# Altium schematic sheet MCU_POWER.SchDoc: STM32 microcontroller Power
size 420 x 297 mm; CompanyName: STMicroelectronics; Organization: Microcontrollers Division; DocumentNumber: 15; SheetNumber: 16; SheetTotal: 17
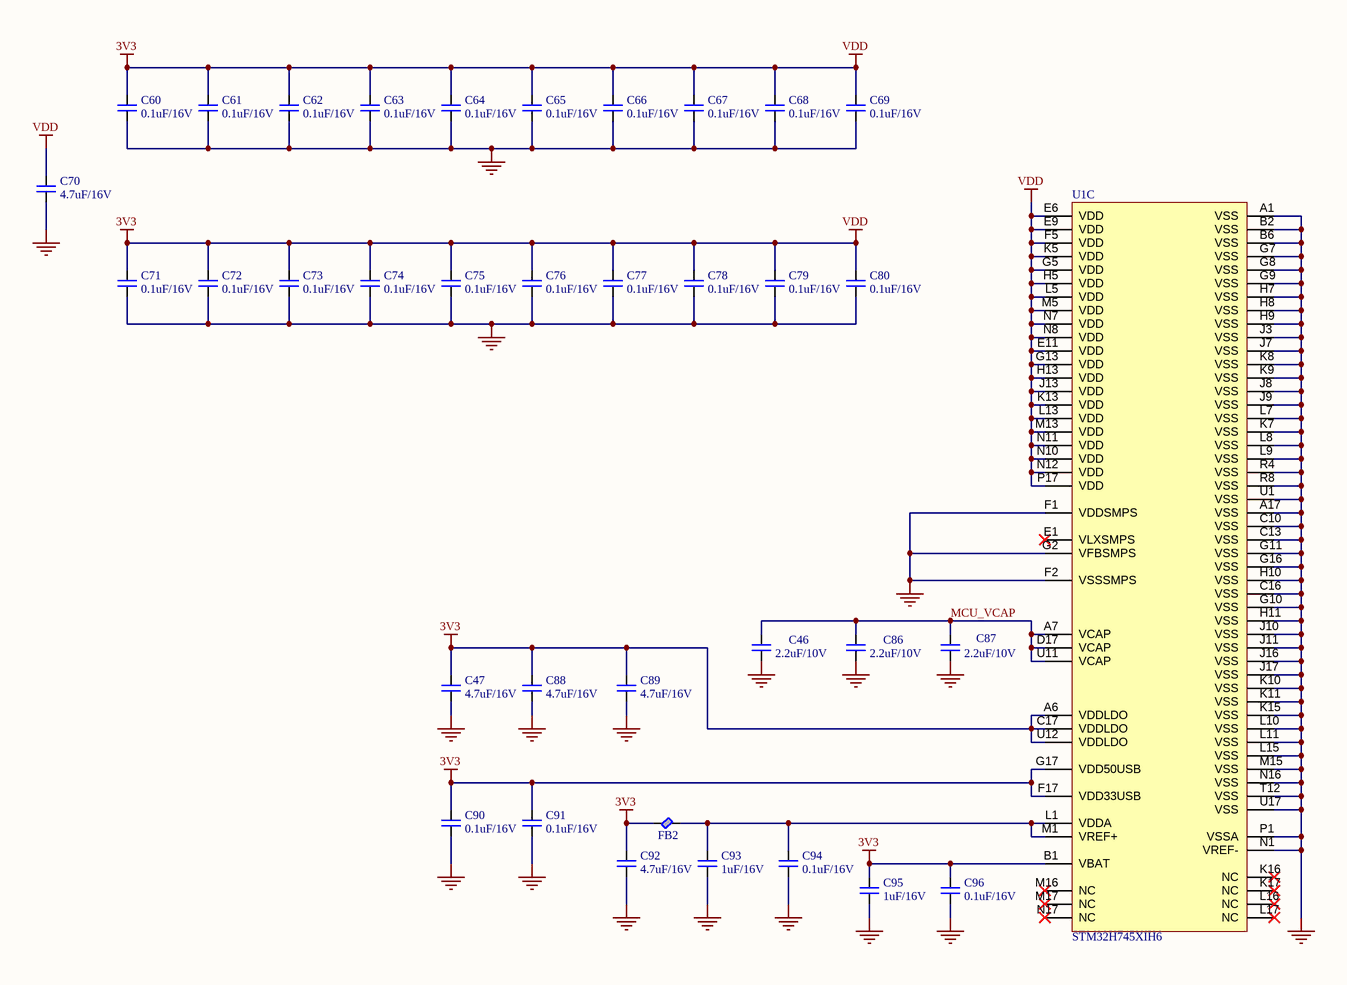
[diagram p0: MCU_POWER.SchDoc]

## Parts
C46  2.2uF/10V  [CAP_C_1608X80]
C47  4.7uF/16V  [CAP_C_1608X80]
C60  0.1uF/16V  [CAP_C_1608X80]
C61  0.1uF/16V  [CAP_C_1608X80]
C62  0.1uF/16V  [CAP_C_1608X80]
C63  0.1uF/16V  [CAP_C_1608X80]
C64  0.1uF/16V  [CAP_C_1608X80]
C65  0.1uF/16V  [CAP_C_1608X80]
C66  0.1uF/16V  [CAP_C_1608X80]
C67  0.1uF/16V  [CAP_C_1608X80]
C68  0.1uF/16V  [CAP_C_1608X80]
C69  0.1uF/16V  [CAP_C_1608X80]
C70  4.7uF/16V  [CAP_C_1608X80]
C71  0.1uF/16V  [CAP_C_1608X80]
C72  0.1uF/16V  [CAP_C_1608X80]
C73  0.1uF/16V  [CAP_C_1608X80]
C74  0.1uF/16V  [CAP_C_1608X80]
C75  0.1uF/16V  [CAP_C_1608X80]
C76  0.1uF/16V  [CAP_C_1608X80]
C77  0.1uF/16V  [CAP_C_1608X80]
C78  0.1uF/16V  [CAP_C_1608X80]
C79  0.1uF/16V  [CAP_C_1608X80]
C80  0.1uF/16V  [CAP_C_1608X80]
C86  2.2uF/10V  [CAP_C_1608X80]
C87  2.2uF/10V  [CAP_C_1608X80]
C88  4.7uF/16V  [CAP_C_1608X80]
C89  4.7uF/16V  [CAP_C_1608X80]
C90  0.1uF/16V  [CAP_C_1608X80]
C91  0.1uF/16V  [CAP_C_1608X80]
C92  4.7uF/16V  [CAP_C_1608X80]
C93  1uF/16V  [CAP_C_1608X80]
C94  0.1uF/16V  [CAP_C_1608X80]
C95  1uF/16V  [CAP_C_1608X80]
C96  0.1uF/16V  [CAP_C_1608X80]
FB2  BLM18PG121SN1D  [IND_1608x65]  (value not drawn)
U1  STM32H745XIH6  [BGA265C80P17X17_1400X1400X110N]  (part C of 3)

## Nets
3V3: C47.1 C60.2 C61.2 C62.2 C63.2 C64.2 C65.2 C66.2 C67.2 C68.2 C69.2 C70.1 C71.2 C72.2 C73.2 C74.2 C75.2 C76.2 C77.2 C78.2 C79.2 C80.2 C88.1 C89.1 C90.2 C91.2 C92.1 C95.2 C96.2 FB2.1 U1.A6(VDDLDO) U1.B1(VBAT) U1.C17(VDDLDO) U1.E6(VDD) U1.E9(VDD) U1.E11(VDD) U1.F5(VDD) U1.F17(VDD33USB) U1.G5(VDD) U1.G13(VDD) U1.G17(VDD50USB) U1.H5(VDD) U1.H13(VDD) U1.J13(VDD) U1.K5(VDD) U1.K13(VDD) U1.L5(VDD) U1.L13(VDD) U1.M5(VDD) U1.M13(VDD) U1.N7(VDD) U1.N8(VDD) U1.N10(VDD) U1.N11(VDD) U1.N12(VDD) U1.P17(VDD) U1.U12(VDDLDO)  [also labelled VDD]
GND: C46.1 C47.2 C60.1 C61.1 C62.1 C63.1 C64.1 C65.1 C66.1 C67.1 C68.1 C69.1 C70.2 C71.1 C72.1 C73.1 C74.1 C75.1 C76.1 C77.1 C78.1 C79.1 C80.1 C86.1 C87.1 C88.2 C89.2 C90.1 C91.1 C92.2 C93.1 C94.1 C95.1 C96.1 U1.A1(VSS) U1.A17(VSS) U1.B2(VSS) U1.B6(VSS) U1.C10(VSS) U1.C13(VSS) U1.C16(VSS) U1.F1(VDDSMPS) U1.F2(VSSSMPS) U1.G2(VFBSMPS) U1.G7(VSS) U1.G8(VSS) U1.G9(VSS) U1.G10(VSS) U1.G11(VSS) U1.G16(VSS) U1.H7(VSS) U1.H8(VSS) U1.H9(VSS) U1.H10(VSS) U1.H11(VSS) U1.J3(VSS) U1.J7(VSS) U1.J8(VSS) U1.J9(VSS) U1.J10(VSS) U1.J11(VSS) U1.J16(VSS) U1.J17(VSS) U1.K7(VSS) U1.K8(VSS) U1.K9(VSS) U1.K10(VSS) U1.K11(VSS) U1.K15(VSS) U1.L7(VSS) U1.L8(VSS) U1.L9(VSS) U1.L10(VSS) U1.L11(VSS) U1.L15(VSS) U1.M15(VSS) U1.N1(VREF-) U1.N16(VSS) U1.P1(VSSA) U1.R4(VSS) U1.R8(VSS) U1.T12(VSS) U1.U1(VSS) U1.U17(VSS)
MCU_VCAP: C46.2 C86.2 C87.2 U1.A7(VCAP) U1.D17(VCAP) U1.U11(VCAP)
NetC93_2: C93.2 C94.2 FB2.2 U1.L1(VDDA) U1.M1(VREF+)

Not connected (* = marked no-connect by the designer): U1 E1(VLXSMPS)* K16(NC)* K17(NC)* L16(NC)* L17(NC)* M16(NC)* M17(NC)* N17(NC)*

## Notes on the sheet
- Project:
- BEE-PC1
- Sub-system:
- NANORACK_EXP_CONTROLLER
- Design by:
- SANG HUYNH
- BAO BUI Q.
- Sheet title:
- Sheet
- A3
- of
- Checked by:
- Approved by:
- VU PHAM
- Revision:
- Document No:
- V1.2.2
- Size:
- Date:

## Library data of the parts
C46 C47 C60-C80 C86-C96 = CAP_SMD: CAP_Chip; Value: 33pF
FB2 = FB: FERRITE BEAD
U1 = STM32H745XIH6: High-performance and DSP with DP-FPU, Arm Cortex-M7 + Cortex-M4 MCU with 2MBytes of Flash memory, 1MB RAM, 480 MHz CPU, Art Accelerator, L1 cache, external memory interface, large set of peripherals, SMPS; Manufacturer_Name: STMicroelectronics; Copyright: Copyright (C) 2025 Ultra Librarian. All rights reserved.; Manufacturer_Part_Number: STM32H745XIH6; Datasheet: https://www.st.com/resource/en/datasheet/stm32h745zg.pdf; RefDes: RefDes; Type: Type